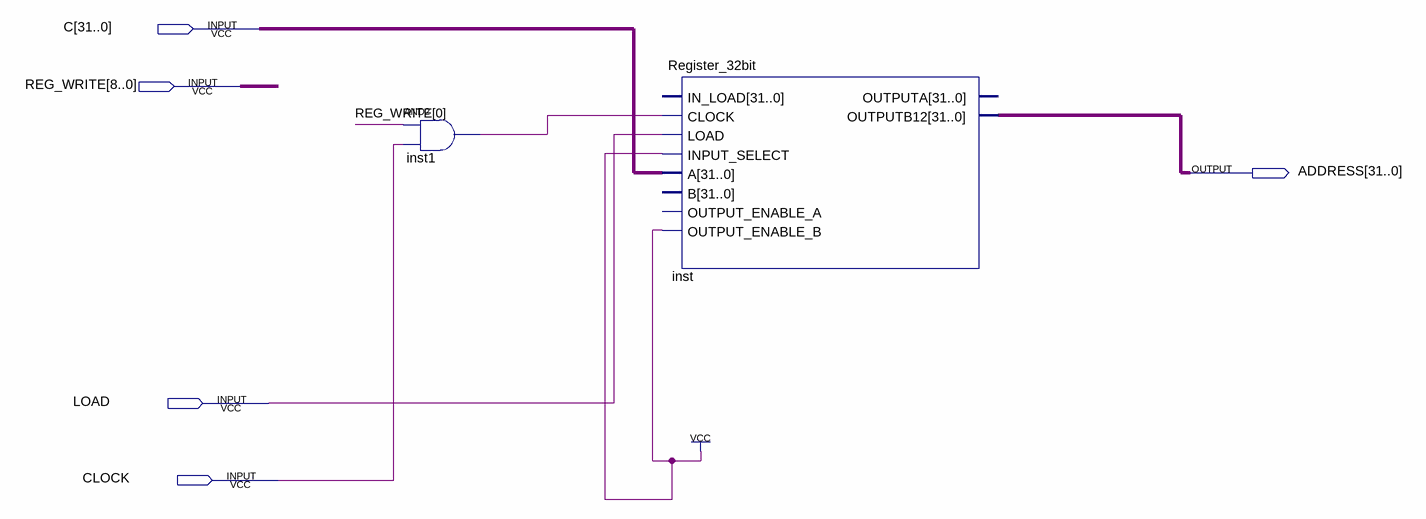
[diagram p0: schematic sheet]
// Quartus schematic MAR.bdf as structural Verilog: 2 symbols, 5 pins
module MAR (
  input  [31:0] C,
  input  [8:0] REG_WRITE,
  input  LOAD,
  input  CLOCK,
  output [31:0] ADDRESS
);

  wire inst1_out;

  and inst1 (inst1_out, REG_WRITE[0], CLOCK);
  Register_32bit inst (
    .CLOCK(inst1_out), .LOAD(LOAD), .INPUT_SELECT(1'b1), .A(C), .OUTPUT_ENABLE_B(1'b1), .OUTPUTB12(ADDRESS));  // open: IN_LOAD, B, OUTPUT_ENABLE_A, OUTPUTA
endmodule
